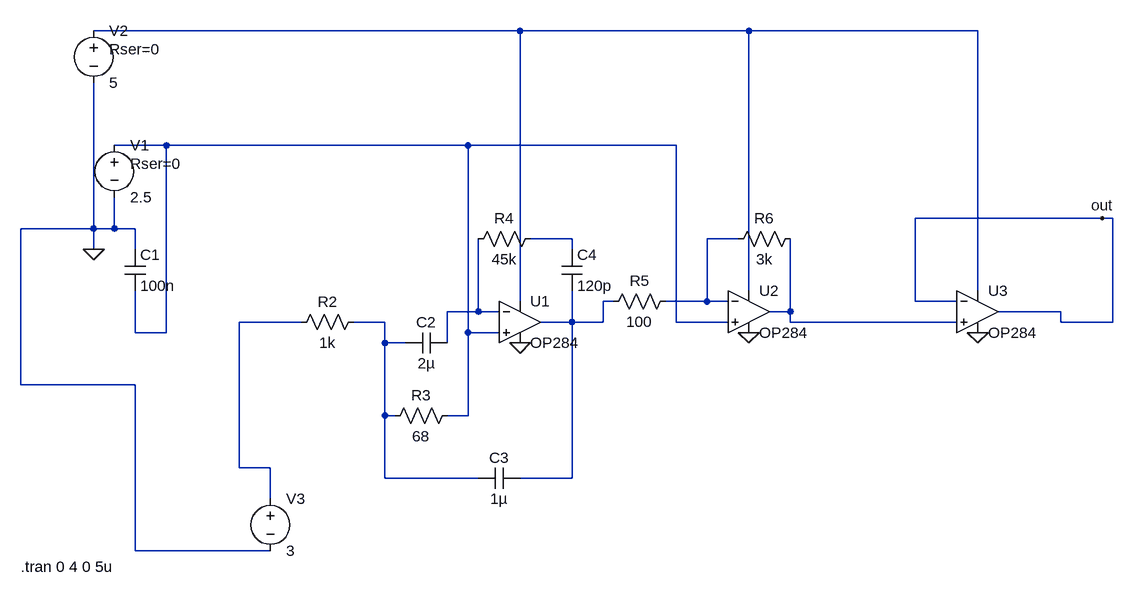
[diagram p0: schematic Draft1dc.asc]
Draft1dc.asc, the LTspice schematic file:
Version 4
SHEET 1 1444 680
WIRE 512 -432 -144 -432
WIRE 864 -432 512 -432
WIRE 1216 -432 864 -432
WIRE -32 -256 -112 -256
WIRE 432 -256 -32 -256
WIRE 752 -256 432 -256
WIRE 1408 -144 1120 -144
WIRE 1424 -144 1408 -144
WIRE -144 -128 -144 -352
WIRE -144 -128 -256 -128
WIRE -112 -128 -112 -176
WIRE -112 -128 -144 -128
WIRE -80 -128 -112 -128
WIRE 592 -112 528 -112
WIRE 848 -112 800 -112
WIRE -144 -96 -144 -128
WIRE -80 -96 -80 -128
WIRE 592 -96 592 -112
WIRE 864 -32 864 -432
WIRE 1216 -32 1216 -432
WIRE 512 -16 512 -432
WIRE 656 -16 640 -16
WIRE 800 -16 800 -112
WIRE 800 -16 736 -16
WIRE 832 -16 800 -16
WIRE 1120 -16 1120 -144
WIRE 1184 -16 1120 -16
WIRE 448 0 448 -112
WIRE 448 0 400 0
WIRE 480 0 448 0
WIRE 928 0 928 -112
WIRE 928 0 896 0
WIRE 1344 0 1248 0
WIRE 176 16 80 16
WIRE 304 16 256 16
WIRE 592 16 592 -32
WIRE 592 16 544 16
WIRE 640 16 640 -16
WIRE 640 16 592 16
WIRE 752 16 752 -256
WIRE 832 16 752 16
WIRE 928 16 928 0
WIRE 1184 16 928 16
WIRE 1344 16 1344 0
WIRE 1424 16 1424 -144
WIRE 1424 16 1344 16
WIRE -80 32 -80 -32
WIRE -32 32 -32 -256
WIRE -32 32 -80 32
WIRE 432 32 432 -256
WIRE 480 32 432 32
WIRE 304 48 304 16
WIRE 336 48 304 48
WIRE 400 48 400 0
WIRE -256 112 -256 -128
WIRE -80 112 -256 112
WIRE 304 160 304 48
WIRE 320 160 304 160
WIRE 432 160 432 32
WIRE 432 160 400 160
WIRE 80 240 80 16
WIRE 128 240 80 240
WIRE 304 256 304 160
WIRE 448 256 304 256
WIRE 592 256 592 16
WIRE 592 256 512 256
WIRE 128 288 128 240
WIRE -80 368 -80 112
WIRE 128 368 -80 368
FLAG 512 48 0
FLAG 864 32 0
FLAG 1216 32 0
FLAG -144 -96 0
FLAG 1408 -144 out
SYMBOL cap -96 -96 R0
SYMATTR InstName C1
SYMATTR Value 100n
SYMBOL res 272 0 R90
WINDOW 0 0 56 VBottom 2
WINDOW 3 32 56 VTop 2
SYMATTR InstName R2
SYMATTR Value 1k
SYMBOL res 416 144 R90
WINDOW 0 0 56 VBottom 2
WINDOW 3 32 56 VTop 2
SYMATTR InstName R3
SYMATTR Value 68
SYMBOL cap 400 32 R90
WINDOW 0 0 32 VBottom 2
WINDOW 3 32 32 VTop 2
SYMATTR InstName C2
SYMATTR Value 2µ
SYMBOL cap 512 240 R90
WINDOW 0 0 32 VBottom 2
WINDOW 3 32 32 VTop 2
SYMATTR InstName C3
SYMATTR Value 1µ
SYMBOL res 544 -128 R90
WINDOW 0 0 56 VBottom 2
WINDOW 3 32 56 VTop 2
SYMATTR InstName R4
SYMATTR Value 45k
SYMBOL res 752 -32 R90
WINDOW 0 0 56 VBottom 2
WINDOW 3 32 56 VTop 2
SYMATTR InstName R5
SYMATTR Value 100
SYMBOL res 944 -128 R90
WINDOW 0 0 56 VBottom 2
WINDOW 3 32 56 VTop 2
SYMATTR InstName R6
SYMATTR Value 3k
SYMBOL voltage -112 -272 R0
WINDOW 123 0 0 Left 0
WINDOW 39 24 44 Left 2
SYMATTR SpiceLine Rser=0
SYMATTR InstName V1
SYMATTR Value 2.5
SYMBOL voltage -144 -448 R0
WINDOW 123 0 0 Left 0
WINDOW 39 24 44 Left 2
SYMATTR SpiceLine Rser=0
SYMATTR InstName V2
SYMATTR Value 5
SYMBOL voltage 128 272 R0
WINDOW 123 0 0 Left 0
WINDOW 39 0 0 Left 0
SYMATTR InstName V3
SYMATTR Value 3
SYMBOL Opamps\\OP284 512 -48 R0
SYMATTR InstName U1
SYMBOL Opamps\\OP284 864 -64 R0
SYMATTR InstName U2
SYMBOL Opamps\\OP284 1216 -64 R0
SYMATTR InstName U3
SYMBOL cap 576 -96 R0
SYMATTR InstName C4
SYMATTR Value 120p
TEXT -256 392 Left 2 !.tran 0 4 0 5u

The netlist it stands for:
* Draft1dc.asc
C1 0 N002 100n
R2 N009 N008 1k
R3 N002 N009 68
C2 N006 N009 2µ
C3 N005 N009 1µ
R4 N003 N006 45k
R5 N004 N005 100
R6 N007 N004 3k
V1 N002 0 2.5 Rser=0
V2 N001 0 5 Rser=0
V3 N008 0 3
XU1 N002 N006 N001 0 N005 OP284  ; pins In+ In- V+ V- OUT
XU2 N002 N004 N001 0 N007 OP284  ; pins In+ In- V+ V- OUT
XU3 N007 out N001 0 out OP284  ; pins In+ In- V+ V- OUT
C4 N003 N005 120p
.tran 0 4 0 5u
.lib ADI1.lib
.backanno
.end